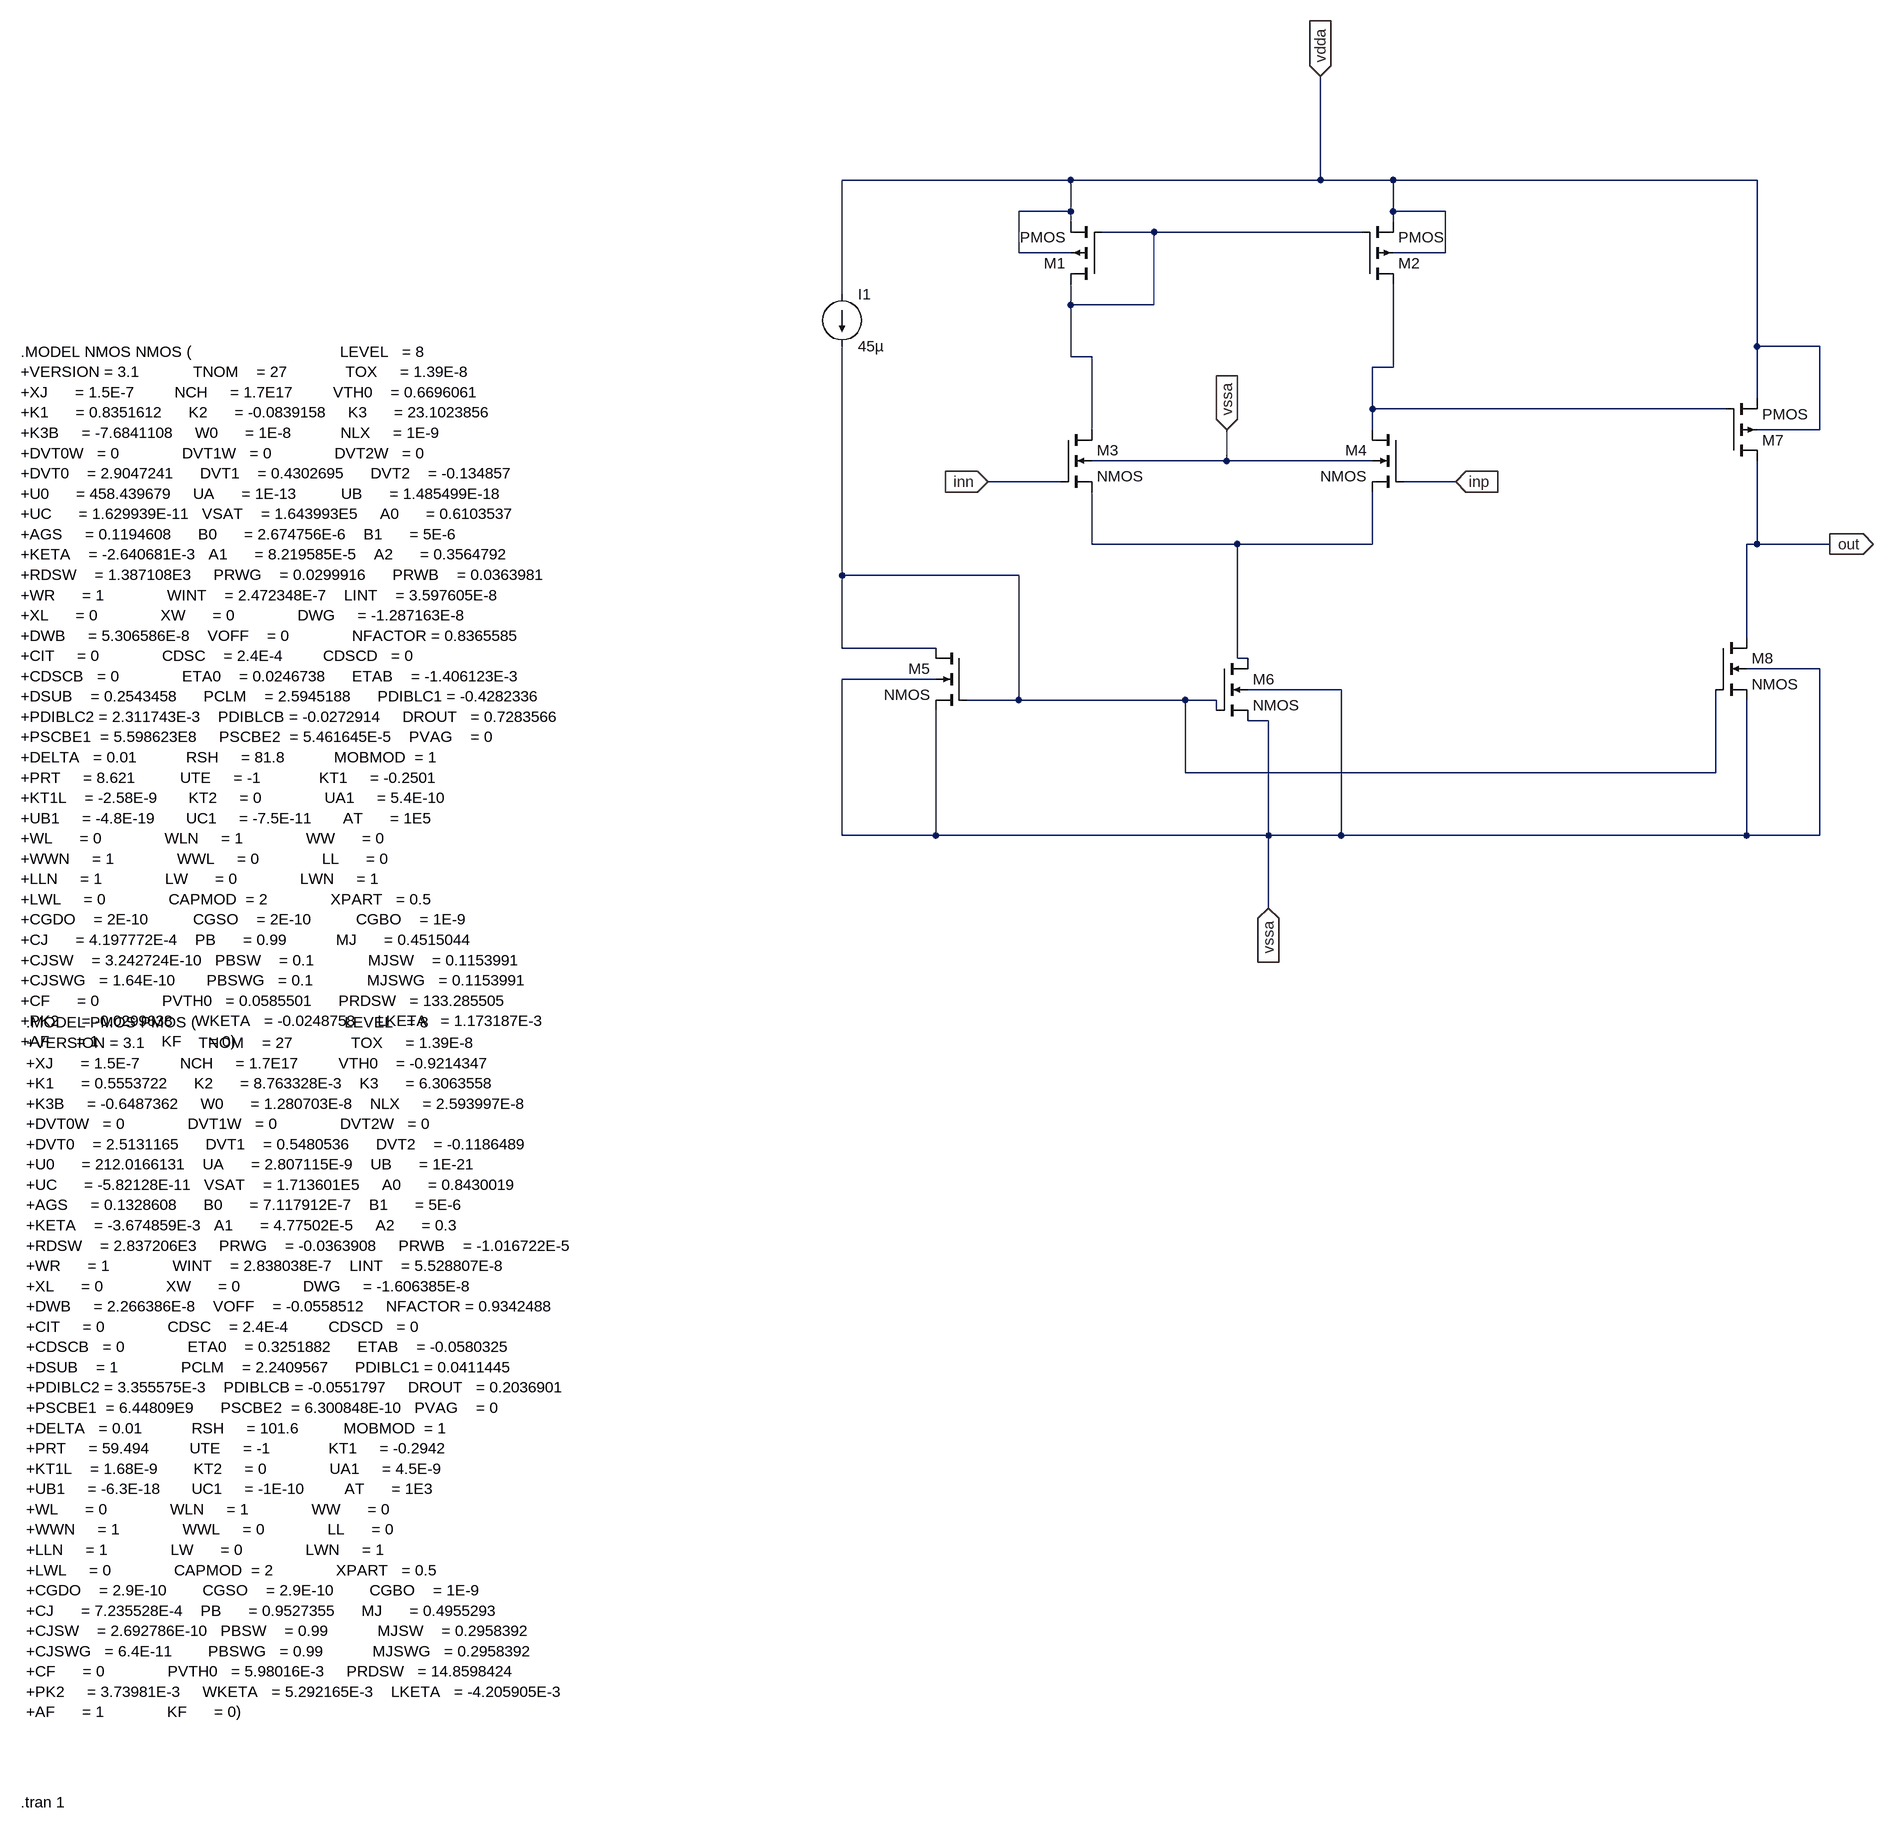
[diagram p0: schematic opamp-schem.asc]
opamp-schem.asc, the LTspice schematic file:
Version 4
SHEET 1 2852 2032
WIRE 1376 -480 1024 -480
WIRE 1760 -480 1760 -640
WIRE 1760 -480 1376 -480
WIRE 1872 -480 1760 -480
WIRE 2432 -480 1872 -480
WIRE 1376 -432 1376 -480
WIRE 1376 -432 1296 -432
WIRE 1872 -432 1872 -480
WIRE 1952 -432 1872 -432
WIRE 1376 -416 1376 -432
WIRE 1872 -416 1872 -432
WIRE 1504 -400 1424 -400
WIRE 1824 -400 1504 -400
WIRE 1296 -368 1296 -432
WIRE 1376 -368 1296 -368
WIRE 1952 -368 1952 -432
WIRE 1952 -368 1872 -368
WIRE 1024 -304 1024 -480
WIRE 1376 -288 1376 -320
WIRE 1504 -288 1504 -400
WIRE 1504 -288 1376 -288
WIRE 2432 -224 2432 -480
WIRE 2528 -224 2432 -224
WIRE 1376 -208 1376 -288
WIRE 1408 -208 1376 -208
WIRE 1872 -192 1872 -320
WIRE 1872 -192 1840 -192
WIRE 2432 -144 2432 -224
WIRE 1840 -128 1840 -192
WIRE 2384 -128 1840 -128
WIRE 1408 -96 1408 -208
WIRE 1840 -96 1840 -128
WIRE 2528 -96 2528 -224
WIRE 2528 -96 2432 -96
WIRE 1616 -48 1616 -96
WIRE 1616 -48 1408 -48
WIRE 1840 -48 1616 -48
WIRE 1360 -16 1248 -16
WIRE 1968 -16 1888 -16
WIRE 1408 80 1408 0
WIRE 1632 80 1408 80
WIRE 1840 80 1840 0
WIRE 1840 80 1632 80
WIRE 2432 80 2432 -48
WIRE 2432 80 2416 80
WIRE 2544 80 2432 80
WIRE 1024 128 1024 -224
WIRE 1296 128 1024 128
WIRE 2416 224 2416 80
WIRE 1024 240 1024 128
WIRE 1168 240 1024 240
WIRE 1632 256 1632 80
WIRE 1648 256 1632 256
WIRE 2528 272 2416 272
WIRE 1168 288 1024 288
WIRE 1792 304 1648 304
WIRE 1296 320 1296 128
WIRE 1296 320 1216 320
WIRE 1552 320 1296 320
WIRE 1600 320 1552 320
WIRE 1600 336 1600 320
WIRE 1680 352 1648 352
WIRE 1552 432 1552 320
WIRE 2368 432 2368 304
WIRE 2368 432 1552 432
WIRE 1024 528 1024 288
WIRE 1168 528 1168 336
WIRE 1168 528 1024 528
WIRE 1680 528 1680 352
WIRE 1680 528 1168 528
WIRE 1792 528 1792 304
WIRE 1792 528 1680 528
WIRE 2416 528 2416 320
WIRE 2416 528 1792 528
WIRE 2528 528 2528 272
WIRE 2528 528 2416 528
WIRE 1680 640 1680 528
FLAG 1760 -640 vdda
IOPIN 1760 -640 In
FLAG 1248 -16 inn
IOPIN 1248 -16 In
FLAG 2544 80 out
IOPIN 2544 80 Out
FLAG 1616 -96 vssa
IOPIN 1616 -96 In
FLAG 1680 640 vssa
IOPIN 1680 640 In
FLAG 1968 -16 inp
IOPIN 1968 -16 In
SYMBOL pmos4 1824 -320 M180
SYMATTR InstName M2
SYMATTR Value2 l=0.5u w=10u
SYMBOL pmos4 1424 -320 R180
SYMATTR InstName M1
SYMATTR Value2 l=0.5u w=10u
SYMBOL pmos4 2384 -48 M180
SYMATTR InstName M7
SYMATTR Value2 l=0.5u w=100u
SYMBOL nmos4 1360 -96 R0
SYMATTR InstName M3
SYMATTR Value2 l=0.5u w=5u
SYMBOL nmos4 1888 -96 M0
SYMATTR InstName M4
SYMATTR Value2 l=0.5u w=5u
SYMBOL nmos4 1216 240 M0
SYMATTR InstName M5
SYMATTR Value2 l=0.5u w=5u
SYMBOL nmos4 1600 256 R0
SYMATTR InstName M6
SYMATTR Value2 l=0.5u w=5u
SYMBOL nmos4 2368 224 R0
SYMATTR InstName M8
SYMATTR Value2 l=0.5u w=w8
SYMBOL current 1024 -304 R0
WINDOW 123 0 0 Left 0
WINDOW 39 0 0 Left 0
SYMATTR InstName I1
SYMATTR Value 45µ
TEXT -240 -216 Left 2 !.MODEL NMOS NMOS (                                 LEVEL   = 8\n+VERSION = 3.1            TNOM    = 27             TOX     = 1.39E-8\n+XJ      = 1.5E-7         NCH     = 1.7E17         VTH0    = 0.6696061\n+K1      = 0.8351612      K2      = -0.0839158     K3      = 23.1023856\n+K3B     = -7.6841108     W0      = 1E-8           NLX     = 1E-9\n+DVT0W   = 0              DVT1W   = 0              DVT2W   = 0\n+DVT0    = 2.9047241      DVT1    = 0.4302695      DVT2    = -0.134857\n+U0      = 458.439679     UA      = 1E-13          UB      = 1.485499E-18\n+UC      = 1.629939E-11   VSAT    = 1.643993E5     A0      = 0.6103537\n+AGS     = 0.1194608      B0      = 2.674756E-6    B1      = 5E-6\n+KETA    = -2.640681E-3   A1      = 8.219585E-5    A2      = 0.3564792\n+RDSW    = 1.387108E3     PRWG    = 0.0299916      PRWB    = 0.0363981\n+WR      = 1              WINT    = 2.472348E-7    LINT    = 3.597605E-8\n+XL      = 0              XW      = 0              DWG     = -1.287163E-8\n+DWB     = 5.306586E-8    VOFF    = 0              NFACTOR = 0.8365585\n+CIT     = 0              CDSC    = 2.4E-4         CDSCD   = 0\n+CDSCB   = 0              ETA0    = 0.0246738      ETAB    = -1.406123E-3\n+DSUB    = 0.2543458      PCLM    = 2.5945188      PDIBLC1 = -0.4282336\n+PDIBLC2 = 2.311743E-3    PDIBLCB = -0.0272914     DROUT   = 0.7283566\n+PSCBE1  = 5.598623E8     PSCBE2  = 5.461645E-5    PVAG    = 0\n+DELTA   = 0.01           RSH     = 81.8           MOBMOD  = 1\n+PRT     = 8.621          UTE     = -1             KT1     = -0.2501\n+KT1L    = -2.58E-9       KT2     = 0              UA1     = 5.4E-10\n+UB1     = -4.8E-19       UC1     = -7.5E-11       AT      = 1E5\n+WL      = 0              WLN     = 1              WW      = 0\n+WWN     = 1              WWL     = 0              LL      = 0\n+LLN     = 1              LW      = 0              LWN     = 1\n+LWL     = 0              CAPMOD  = 2              XPART   = 0.5\n+CGDO    = 2E-10          CGSO    = 2E-10          CGBO    = 1E-9\n+CJ      = 4.197772E-4    PB      = 0.99           MJ      = 0.4515044\n+CJSW    = 3.242724E-10   PBSW    = 0.1            MJSW    = 0.1153991\n+CJSWG   = 1.64E-10       PBSWG   = 0.1            MJSWG   = 0.1153991\n+CF      = 0              PVTH0   = 0.0585501      PRDSW   = 133.285505\n+PK2     = -0.0299638     WKETA   = -0.0248758     LKETA   = 1.173187E-3\n+AF      = 1              KF      = 0)
TEXT -240 2016 Left 2 !.tran 1
TEXT -232 816 Left 2 !.MODEL PMOS PMOS (                                 LEVEL   = 8\n+VERSION = 3.1            TNOM    = 27             TOX     = 1.39E-8\n+XJ      = 1.5E-7         NCH     = 1.7E17         VTH0    = -0.9214347\n+K1      = 0.5553722      K2      = 8.763328E-3    K3      = 6.3063558\n+K3B     = -0.6487362     W0      = 1.280703E-8    NLX     = 2.593997E-8\n+DVT0W   = 0              DVT1W   = 0              DVT2W   = 0\n+DVT0    = 2.5131165      DVT1    = 0.5480536      DVT2    = -0.1186489\n+U0      = 212.0166131    UA      = 2.807115E-9    UB      = 1E-21\n+UC      = -5.82128E-11   VSAT    = 1.713601E5     A0      = 0.8430019\n+AGS     = 0.1328608      B0      = 7.117912E-7    B1      = 5E-6\n+KETA    = -3.674859E-3   A1      = 4.77502E-5     A2      = 0.3\n+RDSW    = 2.837206E3     PRWG    = -0.0363908     PRWB    = -1.016722E-5\n+WR      = 1              WINT    = 2.838038E-7    LINT    = 5.528807E-8\n+XL      = 0              XW      = 0              DWG     = -1.606385E-8\n+DWB     = 2.266386E-8    VOFF    = -0.0558512     NFACTOR = 0.9342488\n+CIT     = 0              CDSC    = 2.4E-4         CDSCD   = 0\n+CDSCB   = 0              ETA0    = 0.3251882      ETAB    = -0.0580325\n+DSUB    = 1              PCLM    = 2.2409567      PDIBLC1 = 0.0411445\n+PDIBLC2 = 3.355575E-3    PDIBLCB = -0.0551797     DROUT   = 0.2036901\n+PSCBE1  = 6.44809E9      PSCBE2  = 6.300848E-10   PVAG    = 0\n+DELTA   = 0.01           RSH     = 101.6          MOBMOD  = 1\n+PRT     = 59.494         UTE     = -1             KT1     = -0.2942\n+KT1L    = 1.68E-9        KT2     = 0              UA1     = 4.5E-9\n+UB1     = -6.3E-18       UC1     = -1E-10         AT      = 1E3\n+WL      = 0              WLN     = 1              WW      = 0\n+WWN     = 1              WWL     = 0              LL      = 0\n+LLN     = 1              LW      = 0              LWN     = 1\n+LWL     = 0              CAPMOD  = 2              XPART   = 0.5\n+CGDO    = 2.9E-10        CGSO    = 2.9E-10        CGBO    = 1E-9\n+CJ      = 7.235528E-4    PB      = 0.9527355      MJ      = 0.4955293\n+CJSW    = 2.692786E-10   PBSW    = 0.99           MJSW    = 0.2958392\n+CJSWG   = 6.4E-11        PBSWG   = 0.99           MJSWG   = 0.2958392\n+CF      = 0              PVTH0   = 5.98016E-3     PRDSW   = 14.8598424\n+PK2     = 3.73981E-3     WKETA   = 5.292165E-3    LKETA   = -4.205905E-3 \n+AF      = 1              KF      = 0)

The netlist it stands for:
* opamp-schem.asc
M2 N002 N001 vdda vdda PMOS l=0.5u w=10u
M1 N001 N001 vdda vdda PMOS l=0.5u w=10u
M7 out N002 vdda vdda PMOS l=0.5u w=100u
M3 N001 inn N003 vssa NMOS l=0.5u w=5u
M4 N002 inp N003 vssa NMOS l=0.5u w=5u
M5 N004 N004 vssa vssa NMOS l=0.5u w=5u
M6 N003 N004 vssa vssa NMOS l=0.5u w=5u
M8 out N004 vssa vssa NMOS l=0.5u w=w8
I1 vdda N004 45µ
.model NMOS NMOS
.model PMOS PMOS
.lib standard.mos
.MODEL NMOS NMOS (                                 LEVEL   = 8
+VERSION = 3.1            TNOM    = 27             TOX     = 1.39E-8
+XJ      = 1.5E-7         NCH     = 1.7E17         VTH0    = 0.6696061
+K1      = 0.8351612      K2      = -0.0839158     K3      = 23.1023856
+K3B     = -7.6841108     W0      = 1E-8           NLX     = 1E-9
+DVT0W   = 0              DVT1W   = 0              DVT2W   = 0
+DVT0    = 2.9047241      DVT1    = 0.4302695      DVT2    = -0.134857
+U0      = 458.439679     UA      = 1E-13          UB      = 1.485499E-18
+UC      = 1.629939E-11   VSAT    = 1.643993E5     A0      = 0.6103537
+AGS     = 0.1194608      B0      = 2.674756E-6    B1      = 5E-6
+KETA    = -2.640681E-3   A1      = 8.219585E-5    A2      = 0.3564792
+RDSW    = 1.387108E3     PRWG    = 0.0299916      PRWB    = 0.0363981
+WR      = 1              WINT    = 2.472348E-7    LINT    = 3.597605E-8
+XL      = 0              XW      = 0              DWG     = -1.287163E-8
+DWB     = 5.306586E-8    VOFF    = 0              NFACTOR = 0.8365585
+CIT     = 0              CDSC    = 2.4E-4         CDSCD   = 0
+CDSCB   = 0              ETA0    = 0.0246738      ETAB    = -1.406123E-3
+DSUB    = 0.2543458      PCLM    = 2.5945188      PDIBLC1 = -0.4282336
+PDIBLC2 = 2.311743E-3    PDIBLCB = -0.0272914     DROUT   = 0.7283566
+PSCBE1  = 5.598623E8     PSCBE2  = 5.461645E-5    PVAG    = 0
+DELTA   = 0.01           RSH     = 81.8           MOBMOD  = 1
+PRT     = 8.621          UTE     = -1             KT1     = -0.2501
+KT1L    = -2.58E-9       KT2     = 0              UA1     = 5.4E-10
+UB1     = -4.8E-19       UC1     = -7.5E-11       AT      = 1E5
+WL      = 0              WLN     = 1              WW      = 0
+WWN     = 1              WWL     = 0              LL      = 0
+LLN     = 1              LW      = 0              LWN     = 1
+LWL     = 0              CAPMOD  = 2              XPART   = 0.5
+CGDO    = 2E-10          CGSO    = 2E-10          CGBO    = 1E-9
+CJ      = 4.197772E-4    PB      = 0.99           MJ      = 0.4515044
+CJSW    = 3.242724E-10   PBSW    = 0.1            MJSW    = 0.1153991
+CJSWG   = 1.64E-10       PBSWG   = 0.1            MJSWG   = 0.1153991
+CF      = 0              PVTH0   = 0.0585501      PRDSW   = 133.285505
+PK2     = -0.0299638     WKETA   = -0.0248758     LKETA   = 1.173187E-3
+AF      = 1              KF      = 0)
.tran 1
.MODEL PMOS PMOS (                                 LEVEL   = 8
+VERSION = 3.1            TNOM    = 27             TOX     = 1.39E-8
+XJ      = 1.5E-7         NCH     = 1.7E17         VTH0    = -0.9214347
+K1      = 0.5553722      K2      = 8.763328E-3    K3      = 6.3063558
+K3B     = -0.6487362     W0      = 1.280703E-8    NLX     = 2.593997E-8
+DVT0W   = 0              DVT1W   = 0              DVT2W   = 0
+DVT0    = 2.5131165      DVT1    = 0.5480536      DVT2    = -0.1186489
+U0      = 212.0166131    UA      = 2.807115E-9    UB      = 1E-21
+UC      = -5.82128E-11   VSAT    = 1.713601E5     A0      = 0.8430019
+AGS     = 0.1328608      B0      = 7.117912E-7    B1      = 5E-6
+KETA    = -3.674859E-3   A1      = 4.77502E-5     A2      = 0.3
+RDSW    = 2.837206E3     PRWG    = -0.0363908     PRWB    = -1.016722E-5
+WR      = 1              WINT    = 2.838038E-7    LINT    = 5.528807E-8
+XL      = 0              XW      = 0              DWG     = -1.606385E-8
+DWB     = 2.266386E-8    VOFF    = -0.0558512     NFACTOR = 0.9342488
+CIT     = 0              CDSC    = 2.4E-4         CDSCD   = 0
+CDSCB   = 0              ETA0    = 0.3251882      ETAB    = -0.0580325
+DSUB    = 1              PCLM    = 2.2409567      PDIBLC1 = 0.0411445
+PDIBLC2 = 3.355575E-3    PDIBLCB = -0.0551797     DROUT   = 0.2036901
+PSCBE1  = 6.44809E9      PSCBE2  = 6.300848E-10   PVAG    = 0
+DELTA   = 0.01           RSH     = 101.6          MOBMOD  = 1
+PRT     = 59.494         UTE     = -1             KT1     = -0.2942
+KT1L    = 1.68E-9        KT2     = 0              UA1     = 4.5E-9
+UB1     = -6.3E-18       UC1     = -1E-10         AT      = 1E3
+WL      = 0              WLN     = 1              WW      = 0
+WWN     = 1              WWL     = 0              LL      = 0
+LLN     = 1              LW      = 0              LWN     = 1
+LWL     = 0              CAPMOD  = 2              XPART   = 0.5
+CGDO    = 2.9E-10        CGSO    = 2.9E-10        CGBO    = 1E-9
+CJ      = 7.235528E-4    PB      = 0.9527355      MJ      = 0.4955293
+CJSW    = 2.692786E-10   PBSW    = 0.99           MJSW    = 0.2958392
+CJSWG   = 6.4E-11        PBSWG   = 0.99           MJSWG   = 0.2958392
+CF      = 0              PVTH0   = 5.98016E-3     PRDSW   = 14.8598424
+PK2     = 3.73981E-3     WKETA   = 5.292165E-3    LKETA   = -4.205905E-3
+AF      = 1              KF      = 0)
.backanno
.end